# Altium project UZ_D_Template.PrjPCB
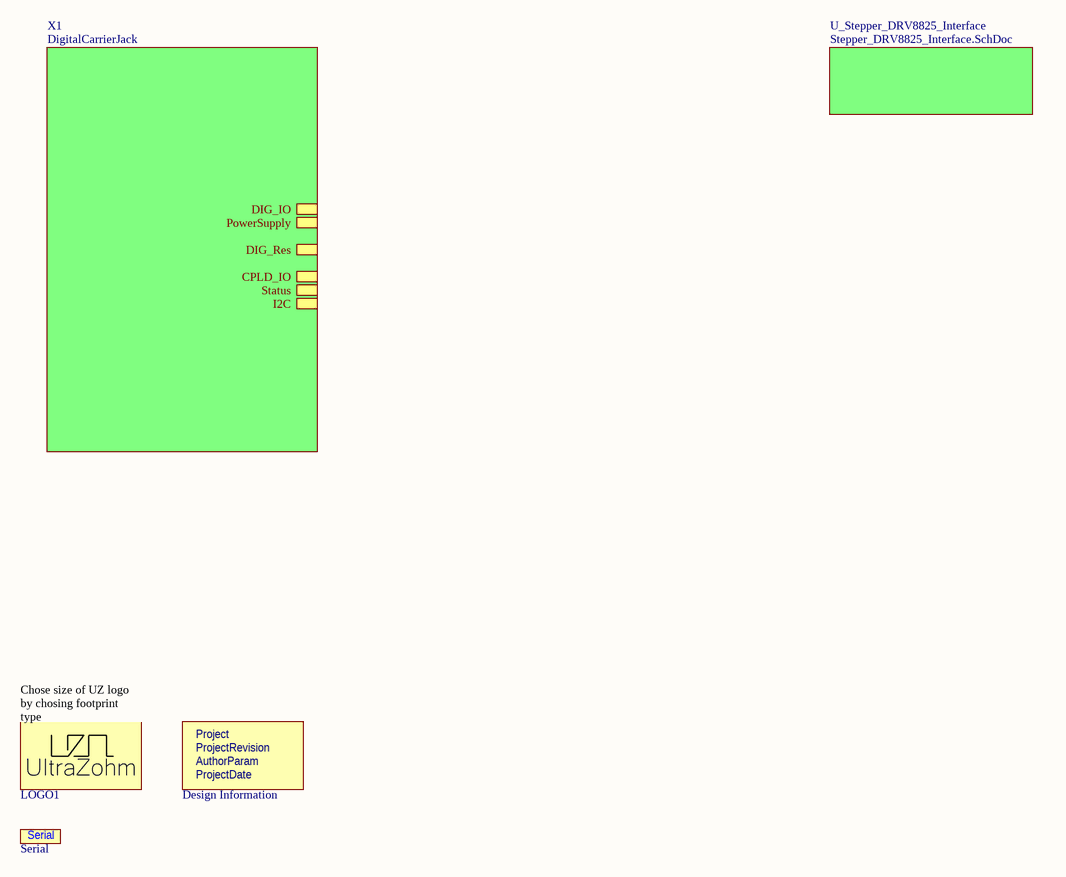
[diagram p0: TopSheet.SchDoc]
ProjectRevision: Rev01; ProjectNameCustom: UZ_D_Template; FinDate: 02/23; AuthorParam: A. Musterfrau; Author: A. Musterfrau
2 sheets, 11 parts. Net scope: hierarchical (ports join the sheet entries above them; power ports are global).
Board file: UZ_D_Template.PcbDoc
Sheets:
  TopSheet.SchDoc
    X1 = DigitalCarrierJack.SchDoc

## Sheet TopSheet.SchDoc
size A4; Author: A. Musterfrau; CompanyName: Technische Hochschule Nürnberg Georg Simon Ohm; Organization: UltraZohm; Address1: Kesslerplatz 12; Address2: 90489 Nürnberg; Address3: GERMANY; DocumentNumber: 1; SheetNumber: 1; SheetTotal: 2; Website: www.ultrazohm.com

### Parts
INFO  Design Information  [Design_info]  (no BOM)
LOGO1  UZ Logo  [UZ_Logo_small]  (value not drawn)  (no BOM)
Serial  Serial #  [SERIAL]  (value not drawn)

### Sub-sheets
U_Stepper_DRV8825_Interface = Stepper_DRV8825_Interface.SchDoc (file not in this document): no entries
X1 = DigitalCarrierJack: DIG_IO (harness DigCon_DIG_IO), PowerSupply (harness DigCon_PowerSupply), DIG_Res (harness DigCon_DIG_Res), CPLD_IO (harness DigCon_DCPLD_IO), Status (harness DigCon_Status), I2C (harness DigCon_I2C)

### Notes on the sheet
- (near LOGO1) Chose size of UZ logo by chosing footprint type
- Title
- Revision:
- Design Engineer:
- Date:
- Project:
- Sheet
- of
- (in symbol Design Information) Project; ProjectRevision; AuthorParam; ProjectDate

### Library data of the parts
INFO = Design Information: Manufacturer: UltraZohm; Created from: MGremer; Manufacturer Part Number: Design Information; PartID: 12; Created On: 03.11.2021 09:04:23; ComponentLink1Description: https://docs.ultrazohm.com/; ComponentLink1URL: homepage; Component Type: Design Information; Last Updated: 03.11.2021 09:28:34; Supplier 1: -; Supplier Part Number 1: -; Type: Design Information; Value: Design Information; Live Cycle Status: 1
LOGO1 = 1: Official Project Logo of the UltraZohm; Manufacturer: PCB Manufacturer; Manufacturer Part Number: UltraZohm Logo; Created from: T. Wendt; PartID: 1; Created On: 19.02.2021 16:55:56; ComponentLink1Description: Homepage; ComponentLink1URL: https://ultrazohm.com; Component Type: Logo; Last Updated: 02.03.2021 14:31:24; Type: Standard (No BOM); Live Cycle Status: 1
Serial = 6: Field to put in a serial number; Manufacturer: PCB Manufacturer; Created from: T. Wendt; PartID: 6; Created On: 02.03.2021 14:31:24; Component Type: Serial Number; Last Updated: 02.03.2021 14:31:24; Manufacturer Part Number: Serial Number; Type: Standard (No BOM); Live Cycle Status: 1

## Sheet DigitalCarrierJack.SchDoc
size A4; Author: A. Musterfrau; CompanyName: Technische Hochschule Nürnberg Georg Simon Ohm; Organization: UltraZohm; Address1: Kesslerplatz 12; Address2: 90489 Nürnberg; Address3: GERMANY; DocumentNumber: 2; SheetNumber: 2; SheetTotal: 2; Website: www.ultrazohm.com
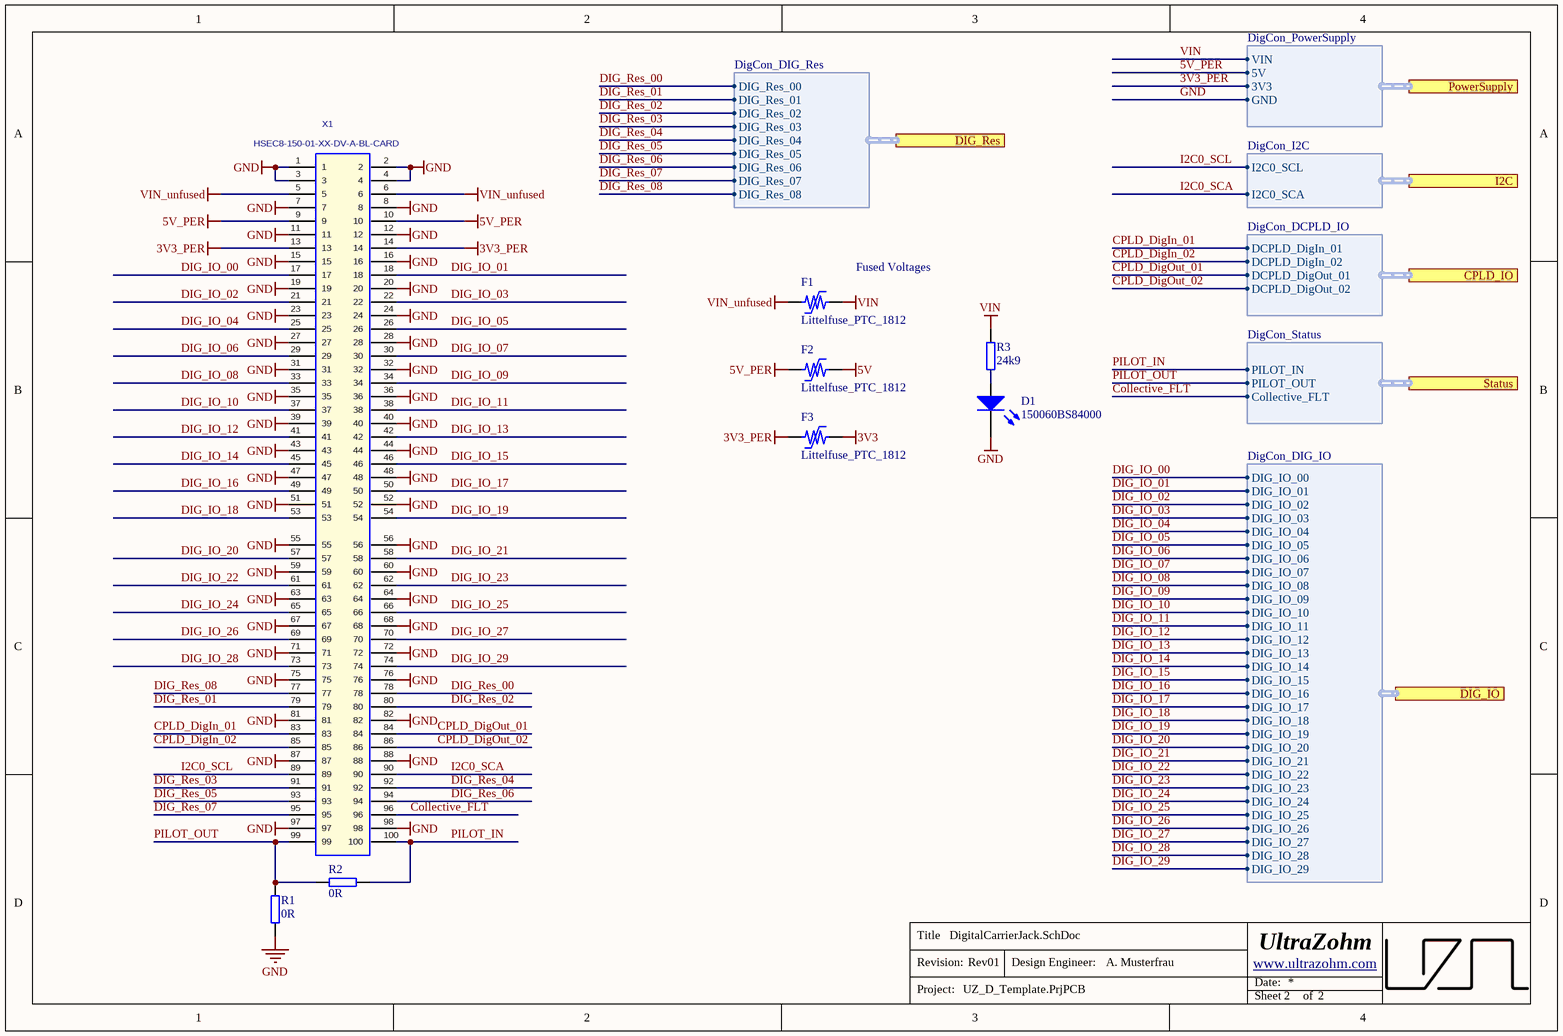
[diagram p1: DigitalCarrierJack.SchDoc]

### Parts
D1  150060BS84000  [WL-SMCW_0603]
F1  Littelfuse_PTC_1812  [1812_PTC_Polyfuse_Littelfuse]
F2  Littelfuse_PTC_1812  [1812_PTC_Polyfuse_Littelfuse]
F3  Littelfuse_PTC_1812  [1812_PTC_Polyfuse_Littelfuse]
R1  0R  [RES 0603_1608]
R2  0R  [RES 0603_1608]
R3  24k9  [RES 0603_1608]
X1  HSEC8-150-01-XX-DV-A-BL-CARD  [HSEC8-150-01-XX-DV-A-BL-CARD]  (no BOM)

### Ports
CPLD_IO (harness DigCon_DCPLD_IO), DIG_IO (harness DigCon_DIG_IO), DIG_Res (harness DigCon_DIG_Res), I2C (harness DigCon_I2C), PowerSupply (harness DigCon_PowerSupply), Status (harness DigCon_Status)

### Harnesses
DigCon_PowerSupply: GND, 3V3, 5V, VIN
DigCon_I2C: I2C0_SCA, I2C0_SCL
DigCon_Status: PILOT_IN, PILOT_OUT, Collective_FLT
DigCon_DCPLD_IO: DCPLD_DigIn_01, DCPLD_DigIn_02, DCPLD_DigOut_01, DCPLD_DigOut_02
DigCon_DIG_IO: DIG_IO_01, DIG_IO_02, DIG_IO_03, DIG_IO_04, DIG_IO_05, DIG_IO_06, DIG_IO_07, DIG_IO_08, DIG_IO_09, DIG_IO_10, DIG_IO_11, DIG_IO_12, DIG_IO_13, DIG_IO_14, DIG_IO_15, DIG_IO_16, DIG_IO_17, DIG_IO_18, DIG_IO_19, DIG_IO_20, DIG_IO_21, DIG_IO_22, DIG_IO_23, DIG_IO_24, DIG_IO_25, DIG_IO_26, DIG_IO_27, DIG_IO_28, DIG_IO_29, DIG_IO_00
DigCon_DIG_Res: DIG_Res_01, DIG_Res_02, DIG_Res_03, DIG_Res_04, DIG_Res_05, DIG_Res_06, DIG_Res_07, DIG_Res_00, DIG_Res_08

### Nets
3V3: F3.2
3V3_PER: F3.1 X1.13 X1.14 ; port PowerSupply.3V3
5V: F2.2
5V_PER: F2.1 X1.9 X1.10 ; port PowerSupply.5V
GND: D1.1(K) R1.1 X1.1 X1.2 X1.3 X1.4 X1.7 X1.8 X1.11 X1.12 X1.15 X1.16 X1.19 X1.20 X1.23 X1.24 X1.27 X1.28 X1.31 X1.32 X1.35 X1.36 X1.39 X1.40 X1.43 X1.44 X1.47 X1.48 X1.51 X1.52 X1.55 X1.56 X1.59 X1.60 X1.63 X1.64 X1.67 X1.68 X1.71 X1.72 X1.75 X1.76 X1.81 X1.82 X1.87 X1.88 X1.97 X1.98 ; port PowerSupply.GND
VIN: F1.2 R3.2 ; port PowerSupply.VIN
VIN_unfused: F1.1 X1.5 X1.6
Collective_FLT: X1.96 ; port Status.Collective_FLT
CPLD_DigIn_01: X1.83 ; port CPLD_IO.DCPLD_DigIn_01
CPLD_DigIn_02: X1.85 ; port CPLD_IO.DCPLD_DigIn_02
CPLD_DigOut_01: X1.84 ; port CPLD_IO.DCPLD_DigOut_01
CPLD_DigOut_02: X1.86 ; port CPLD_IO.DCPLD_DigOut_02
DIG_IO_00: X1.17 ; port DIG_IO.DIG_IO_00
DIG_IO_01: X1.18 ; port DIG_IO.DIG_IO_01
DIG_IO_02: X1.21 ; port DIG_IO.DIG_IO_02
DIG_IO_03: X1.22 ; port DIG_IO.DIG_IO_03
DIG_IO_04: X1.25 ; port DIG_IO.DIG_IO_04
DIG_IO_05: X1.26 ; port DIG_IO.DIG_IO_05
DIG_IO_06: X1.29 ; port DIG_IO.DIG_IO_06
DIG_IO_07: X1.30 ; port DIG_IO.DIG_IO_07
DIG_IO_08: X1.33 ; port DIG_IO.DIG_IO_08
DIG_IO_09: X1.34 ; port DIG_IO.DIG_IO_09
DIG_IO_10: X1.37 ; port DIG_IO.DIG_IO_10
DIG_IO_11: X1.38 ; port DIG_IO.DIG_IO_11
DIG_IO_12: X1.41 ; port DIG_IO.DIG_IO_12
DIG_IO_13: X1.42 ; port DIG_IO.DIG_IO_13
DIG_IO_14: X1.45 ; port DIG_IO.DIG_IO_14
DIG_IO_15: X1.46 ; port DIG_IO.DIG_IO_15
DIG_IO_16: X1.49 ; port DIG_IO.DIG_IO_16
DIG_IO_17: X1.50 ; port DIG_IO.DIG_IO_17
DIG_IO_18: X1.53 ; port DIG_IO.DIG_IO_18
DIG_IO_19: X1.54 ; port DIG_IO.DIG_IO_19
DIG_IO_20: X1.57 ; port DIG_IO.DIG_IO_20
DIG_IO_21: X1.58 ; port DIG_IO.DIG_IO_21
DIG_IO_22: X1.61 ; port DIG_IO.DIG_IO_22
DIG_IO_23: X1.62 ; port DIG_IO.DIG_IO_23
DIG_IO_24: X1.65 ; port DIG_IO.DIG_IO_24
DIG_IO_25: X1.66 ; port DIG_IO.DIG_IO_25
DIG_IO_26: X1.69 ; port DIG_IO.DIG_IO_26
DIG_IO_27: X1.70 ; port DIG_IO.DIG_IO_27
DIG_IO_28: X1.73 ; port DIG_IO.DIG_IO_28
DIG_IO_29: X1.74 ; port DIG_IO.DIG_IO_29
DIG_Res_00: X1.78 ; port DIG_Res.DIG_Res_00
DIG_Res_01: X1.79 ; port DIG_Res.DIG_Res_01
DIG_Res_02: X1.80 ; port DIG_Res.DIG_Res_02
DIG_Res_03: X1.91 ; port DIG_Res.DIG_Res_03
DIG_Res_04: X1.92 ; port DIG_Res.DIG_Res_04
DIG_Res_05: X1.93 ; port DIG_Res.DIG_Res_05
DIG_Res_06: X1.94 ; port DIG_Res.DIG_Res_06
DIG_Res_07: X1.95 ; port DIG_Res.DIG_Res_07
DIG_Res_08: X1.77 ; port DIG_Res.DIG_Res_08
I2C0_SCA: X1.90 ; port I2C.I2C0_SCA
I2C0_SCL: X1.89 ; port I2C.I2C0_SCL
PILOT_IN: R2.1 X1.100 ; port Status.PILOT_IN
PILOT_OUT: R1.2 R2.2 X1.99 ; port Status.PILOT_OUT
NetD1_2: D1.2(A) R3.1

### Notes on the sheet
- (near F1) Fused Voltages
- Title
- Revision:
- Design Engineer:
- Date:
- Project:
- Sheet
- of

### Library data of the parts
D1 = 150060BS84000: WL-SMCW SMD Mono-color Chip LED Waterclear Blue; Manufacturer: Wuerth Elektronik; Type: Standard; Created from: MGremer; Forward Current I_f: 20 mA; Forward Voltage U_f: 3.2 V; Wavelength: 470 nm; Light Intensity: 560 mcd; Nominal Power: 78 mW; Manufacturer Part Number: 150060BS84000; PartID: 1; Created On: 08.12.2020 10:19:38; ComponentLink1Description: Datasheet; ComponentLink1URL: https://www.mouser.de/datasheet/2/445/150060BS84000-1838909.pdf; Component Type: LED Diode; Device Package: 0603; Last Updated: 03.03.2021 09:59:51; Mounting Type: SMD; Operating Temperature: -40 - 85 °C; Supplier 1: Mouser; Supplier Part Number 1: 710-150060BS84000; Supplier 2: Farnell; Supplier Part Number 2: 3408611; Supplier 3: Digi-Key; Supplier Part Number 3: 732-150060BS84000CT-ND; Live Cycle Status: 1; Stock number: not stored; Color: blue
F1-F3 = Littelfuse_PTC_1812: POLYSWITCH RESETTABLE DEVICES; MPN: miniASMDC110F/24; Value: PTC, 1.1 A, 24V; Voltage: 24V; Trip Current: 2.2A; Hold Current: 1.1A; Resistance: 0.18 Ohm; Type: Fuse; Nominal current: 1 A; Created from: MHlatky; MF: Littelfuse; Created: 2019_02_10_AGeiger; Package: 1812; ComponentLink1URL: https://www.littelfuse.com/~/media/electronics/datasheets/resettable_ptcs/littelfuse_ptc_surface_mount_catalog_datasheet.pdf.pdf; ComponentLink1Description: Datasheet; Manufacturer Part Number: Littelfuse_PTC_1812; PartID: 5; Created On: 07.05.2021 06:50:33; Component Type: Littelfuse_PTC_1812; Last Updated: 27.05.2022 15:06:17; Manufacturer: Littelfuse; Mounting Type: SMD; Operating Temperature: -40 - 85 °C; Supplier 1: Mouser; Supplier Part Number 1: 530-0ZCG0150BF2C; Live Cycle Status: 1; LCSC Part Number: C70119
R1 R2 = RC0603JR-070RL: SMD resistor E24 series; Manufacturer: YAGEO; Tolerance: 5%; Created from: MGremer; Manufacturer Part Number: RC0603JR-070RL; PartID: 1; Created On: 14.12.2020 16:17:14; ComponentLink1Description: Datasheet; ComponentLink1URL: https://www.mouser.de/datasheet/2/447/PYu-RC_Group_51_RoHS_L_10-1664068.pdf; Component Type: SMD resistor; Device Package: 0603; Last Updated: 04.03.2021 09:09:42; Mounting Type: SMD; Supplier 1: Mouser; Supplier Part Number 1: 603-RC0603JR-070RL; Supplier 2: LCSC; Supplier Part Number 2: C21189; Type: Resistor; Value: 0R; Live Cycle Status: 1; Stock number: Labor SMD Container; LCSC Part Number: C21189
R3 = CRCW060324K9FKEA: SMD resistor 1%; Manufacturer: Vishay; Created from: MGremer; Manufacturer Part Number: CRCW060324K9FKEA; PartID: 157; Created On: 14.12.2020 16:17:14; ComponentLink1Description: Datasheet; ComponentLink1URL: https://www.mouser.de/datasheet/2/427/dcrcwe3-1762152.pdf; Component Type: SMD resistor; Device Package: 0603; Last Updated: 02.03.2021 14:07:32; Mounting Type: SMD; Supplier 1: Mouser; Supplier Part Number 1: 71-CRCW0603-24.9K-E3; Type: Resistor; Tolerance: 1%; Value: 24k9; Live Cycle Status: 1; Stock number: not stored
X1 = HSEC8-150-01-XX-DV-A-BL-CARD: Mating Card Layout for HSEC8-150-01-XX-DV-A-BL; Manufacturer: SAMTEC; Created: 2018_04_23_AGeiger; Value: HSEC8-150-01-XX-DV-A-BL-CARD

## Assembly variants
Default: not fitted R1